# Altium schematic sheet USBCharger.SchDoc
size B; SheetNumber: 2; SheetTotal: 2
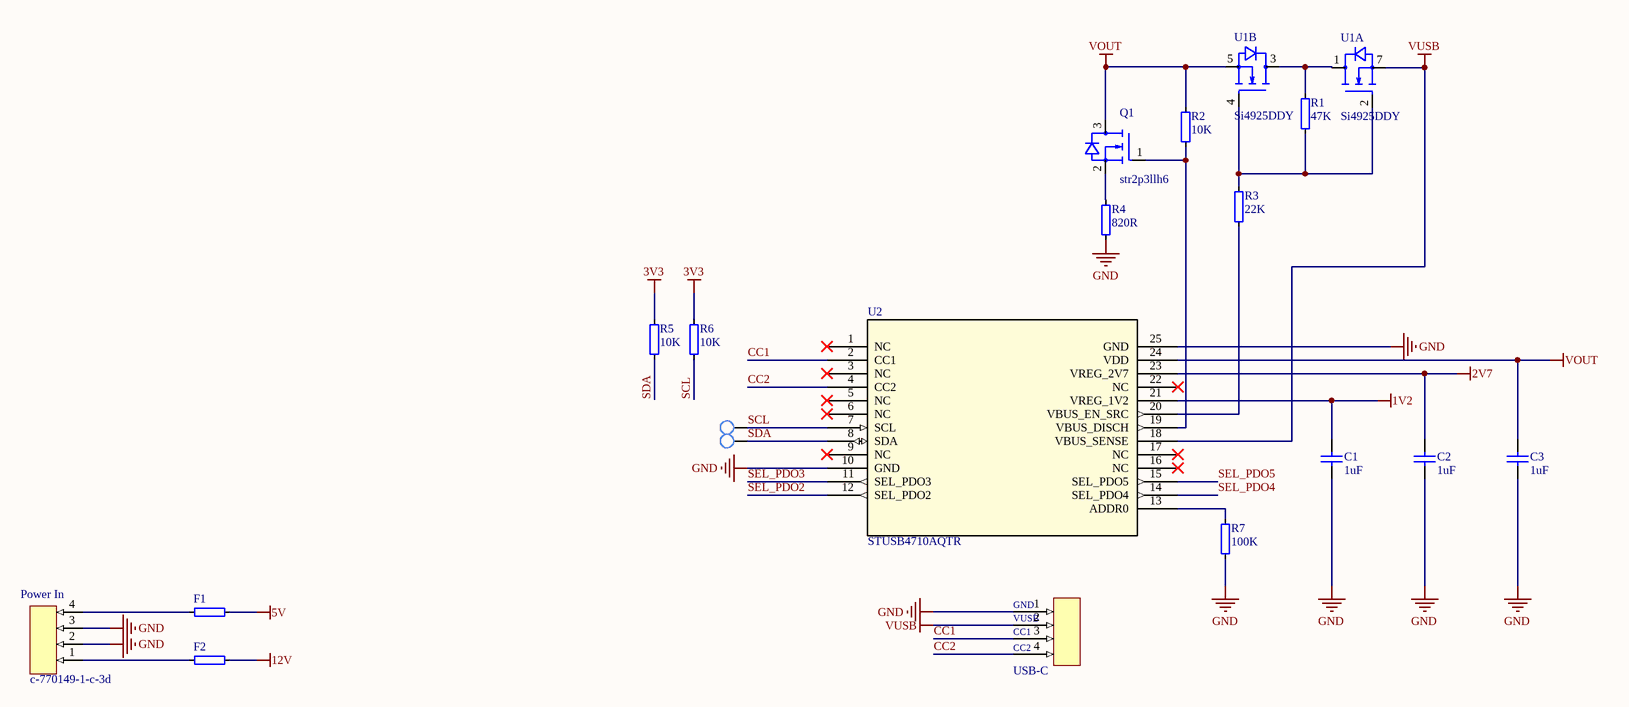
[diagram p0: USBCharger.SchDoc]

## Parts
C1  1uF  [C0603]
C2  1uF  [C0603]
C3  1uF  [C0603]
F1  0154010.DR  [0154010.DR]  (value not drawn)
F2  0154010.DR  [0154010.DR]  (value not drawn)
Power_In  c-770149-1-c-3d  [c-770149-1-c-3d]
Q1  str2p3llh6  [SOT23-3]
R1  47K  [RES0603R]
R2  10K  [RES0603R]
R3  22K  [RES0603R]
R4  820R  [RES1206R]
R5  10K  [RES0603R]
R6  10K  [RES0603R]
R7  100K  [RES0603R]
SCL1  DNP  [smd tp]  (value not drawn)
SDA1  DNP  [smd tp]  (value not drawn)
U1  Si4925DDY  [si4925dd]  (parts A,B of 2)
U2  STUSB4710AQTR  [STUSB4710AQTR]
USB-C  TYPE-C-31-M-17  [TYPE-C-31-M-17]  (value not drawn)

## Nets
1V2: C1.2 U2.21(VREG_1V2)
2V7: C2.2 U2.23(VREG_2V7)
3V3: R5.2 R6.2
5V: F1.2
12V: F2.2
GND: C1.1 C2.1 C3.1 Power_In.2 Power_In.3 R4.1 R7.1 U2.10(GND) U2.25(GND) USB-C.1
VOUT: C3.2 Q1.3(D) R2.2 U1.5(S) U2.24(VDD)
VUSB: U1.7(S) U2.18(VBUS_SENSE) USB-C.2
CC1: U2.2(CC1) USB-C.3
CC2: U2.4(CC2) USB-C.4
SCL: R6.1 SCL1.1 U2.7(SCL)
SDA: R5.1 SDA1.1 U2.8(SDA)
SEL_PDO2: U2.12(SEL_PDO2)
SEL_PDO3: U2.11(SEL_PDO3)
SEL_PDO4: U2.14(SEL_PDO4)
SEL_PDO5: U2.15(SEL_PDO5)
NetF1_1: F1.1 Power_In.4
NetF2_1: F2.1 Power_In.1
NetQ1_1: Q1.1(G) R2.1 U2.19(VBUS_DISCH)
NetQ1_2: Q1.2(S) R4.2
NetR1_1: R1.1 R3.2 U1.2(G) U1.4(G)
NetR1_2: R1.2 U1.1(D) U1.3(D)
NetR3_1: R3.1 U2.20(VBUS_EN_SRC)
NetR7_2: R7.2 U2.13(ADDR0)

Not connected (* = marked no-connect by the designer): U2 1(NC)* 3(NC)* 5(NC)* 6(NC)* 9(NC)* 16(NC)* 17(NC)* 22(NC)*

## Notes on the sheet
- (in symbol TYPE-C-31-M-17) GND; VUSB; CC1; CC2

## Library data of the parts
C1-C3 = CAP: Capacitor; Value: 100pF; Published: 8-Jun-2000; Revision: July-2002: Re-released for DXP Platform.; Publisher: Altium Limited
F1 F2 = Fuse: Polymeric PTC Resettable Fuse 6V 750mA Ih Surface Mount 1206 (3216 Metric), Concave; Part Number: R0201-0R; Part number IPS: 00000003245; Value: 0R; Note: Chip Res 5%; Artikkelnr Noca: N.A.; Manufacturer: *; Manufacturer Part Number: *; ComponentLink1URL: *; ComponentLink1Description: Datasheet; ComponentLink2URL: *; ComponentLink2Description: Supplier link; HelpURL: *; Footprint Doc: 0201; LatestRevisionDate: 2017-11-09; Pin Count: 2; Publisher: Nordic Semiconductor; Published: 2014-11-13; Supplier 1: Digi-Key; Supplier Part Number 1: MF-NSMF075-2CT-ND
Power_In = 4 Pin connector: Generic 4 pin connector, see footprint for MPN
Q1 = Transistor: N-Channel 20V 100mA _Ta_ 150mW _Ta_ Surface Mount VMT3; MF: Rohm; MP: RUM001L02T2CL; Value: *; SnapEDA_Link: https://www.snapeda.com/parts/RUM001L02T2CL/Rohm/view-part/531428/?ref=snap; Digi-Key_Part_Number: RUM001L02T2CLCT-ND; Digi-Key_Purchase_URL: https://www.digikey.com/product-detail/en/rohm-semiconductor/RUM001L02T2CL/RUM001L02T2CLCT-ND/4571412?utm_source=snapeda&utm_medium=aggregator&utm_campaign=symbol; Package: SOT-723 Rohm
R1-R7 = RES: Resistor, ±5%, 0.05W; Part Number: R0201-0R; Part number IPS: 00000003245; Value: 0R; Note: Chip Res 5%; Artikkelnr Noca: N.A.; Manufacturer: *; Manufacturer Part Number: *; ComponentLink1URL: *; ComponentLink1Description: Datasheet; ComponentLink2URL: *; ComponentLink2Description: Supplier link; HelpURL: *; Footprint Doc: 0201; LatestRevisionDate: 2017-11-09; Pin Count: 2; Publisher: Nordic Semiconductor; Published: 2014-11-13; Supplier 1: *; Supplier Part Number 1: *; Supplier 2: *; Supplier Part Number 2: *
SCL1 SDA1 = TP
U1 = Si4925DDY: Si4925DDY, dual mosfet
U2 = STUSB4710AQTR: No Description Available; Vendor: STMicroelectronics; Built_By: EMA_Cory; SourceLibrary: Add_to_database_2020-12-21; Datasheet: https://www.st.com/resource/en/datasheet/stusb4710.pdf; Manufacturer_Part_Number: STUSB4710AQTR; Copyright: Copyright (C) 2018 Accelerated Designs. All rights reserved; RefDes: RefDes; Type: DEV
USB-C = TYPE-C-31-M-17: Usb C power connector; Manufacturer Part Number: TYPE-C-31-M-17